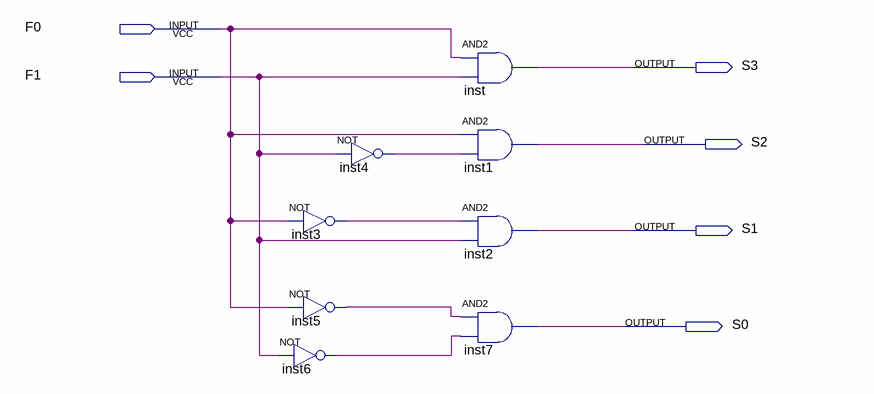
[diagram p0: schematic sheet]
// Quartus schematic DECODER_2TO4.bdf as structural Verilog: 8 symbols, 6 pins
module DECODER_2TO4 (
  input  F0,
  input  F1,
  output S3,
  output S2,
  output S1,
  output S0
);

  wire inst3_out, inst4_out, inst5_out, inst6_out;

  not inst3 (inst3_out, F0);
  not inst5 (inst5_out, F0);
  not inst6 (inst6_out, F1);
  not inst4 (inst4_out, F1);
  and inst (S3, F0, F1);
  and inst1 (S2, F0, inst4_out);
  and inst2 (S1, inst3_out, F1);
  and inst7 (S0, inst5_out, inst6_out);
endmodule
